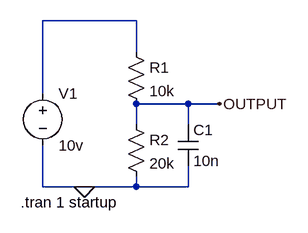
[diagram p0: schematic VOLTAGE_DIVIDER.asc]
VOLTAGE_DIVIDER.asc, the LTspice schematic file:
Version 4
SHEET 1 880 680
WIRE 256 16 112 16
WIRE 256 64 256 16
WIRE 112 128 112 16
WIRE 336 144 256 144
WIRE 384 144 336 144
WIRE 256 176 256 144
WIRE 336 176 336 144
WIRE 112 272 112 208
WIRE 176 272 112 272
WIRE 256 272 256 256
WIRE 256 272 176 272
WIRE 336 272 336 240
WIRE 336 272 256 272
FLAG 176 272 0
FLAG 384 144 OUTPUT
SYMBOL res 240 48 R0
SYMATTR InstName R1
SYMATTR Value 10k
SYMBOL res 240 160 R0
SYMATTR InstName R2
SYMATTR Value 20k
SYMBOL voltage 112 112 R0
WINDOW 123 0 0 Left 0
WINDOW 39 0 0 Left 0
SYMATTR InstName V1
SYMATTR Value 10v
SYMBOL cap 320 176 R0
SYMATTR InstName C1
SYMATTR Value 10n
TEXT 78 296 Left 2 !.tran 1 startup

The netlist it stands for:
* VOLTAGE_DIVIDER.asc
R1 N001 OUTPUT 10k
R2 OUTPUT 0 20k
V1 N001 0 10v
C1 OUTPUT 0 10n
.tran 1 startup
.backanno
.end